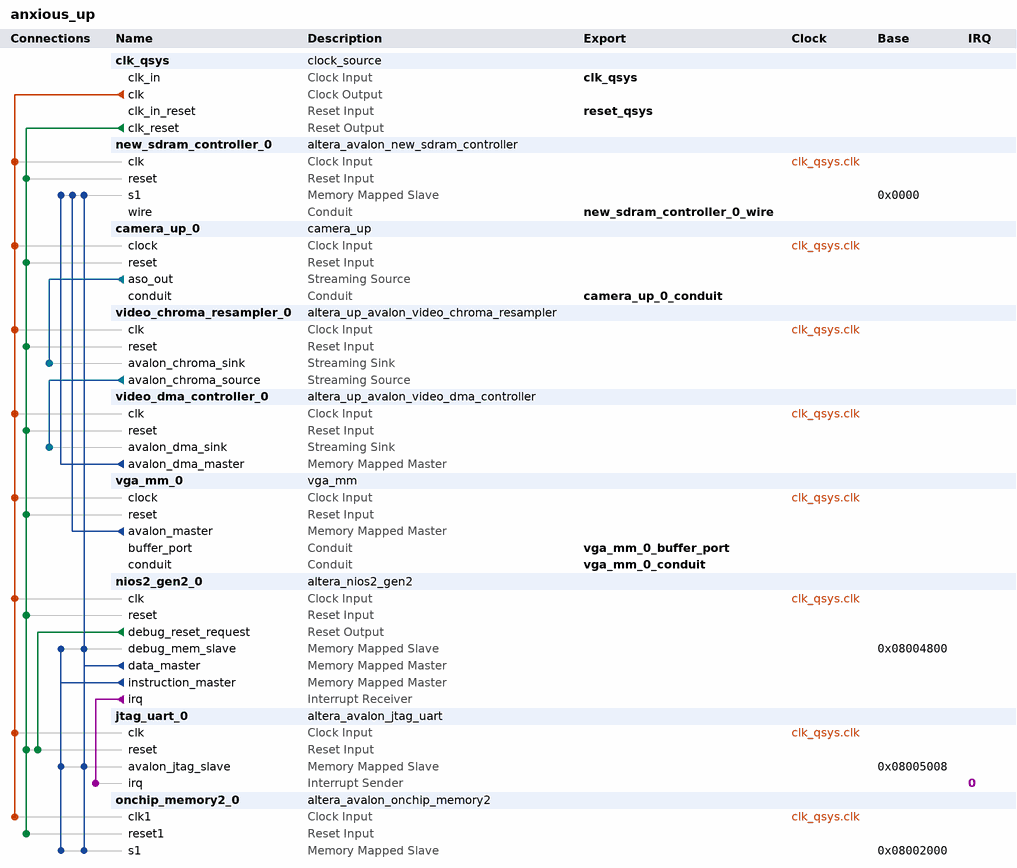
[diagram p0: system contents]
# Platform Designer (Qsys) system anxious_up, Cyclone IV GX EP4CGX150DF31C7
# Parameters at their usual value, and those the tool derives, are not listed.
package require -exact qsys 15.0
create_system anxious_up
set_project_property DEVICE_FAMILY {Cyclone IV GX}
set_project_property DEVICE EP4CGX150DF31C7

add_instance clk_qsys clock_source 15.0
set_instance_parameter_value clk_qsys clockFrequency 50000000

add_instance new_sdram_controller_0 altera_avalon_new_sdram_controller 15.0
set_instance_parameter_value new_sdram_controller_0 TAC 5.5
set_instance_parameter_value new_sdram_controller_0 TRCD 20.0
set_instance_parameter_value new_sdram_controller_0 TRP 20.0
set_instance_parameter_value new_sdram_controller_0 casLatency 3
set_instance_parameter_value new_sdram_controller_0 columnWidth 10
set_instance_parameter_value new_sdram_controller_0 dataWidth 32
set_instance_parameter_value new_sdram_controller_0 generateSimulationModel true
set_instance_parameter_value new_sdram_controller_0 initRefreshCommands 8
set_instance_parameter_value new_sdram_controller_0 model single_Micron_MT48LC4M32B2_7_chip
set_instance_parameter_value new_sdram_controller_0 numberOfBanks 4
set_instance_parameter_value new_sdram_controller_0 numberOfChipSelects 1
set_instance_parameter_value new_sdram_controller_0 powerUpDelay 100.0
set_instance_parameter_value new_sdram_controller_0 refreshPeriod 7.8125
set_instance_parameter_value new_sdram_controller_0 rowWidth 13

add_instance camera_up_0 camera_up 1.0
set_instance_parameter_value camera_up_0 DATA_WIDTH 16
set_instance_parameter_value camera_up_0 FIFO_LENGTH_LOG_2 8

add_instance video_chroma_resampler_0 altera_up_avalon_video_chroma_resampler 15.0

add_instance video_dma_controller_0 altera_up_avalon_video_dma_controller 15.0
set_instance_parameter_value video_dma_controller_0 addr_mode X-Y
set_instance_parameter_value video_dma_controller_0 back_start_address 0
set_instance_parameter_value video_dma_controller_0 color_bits 8
set_instance_parameter_value video_dma_controller_0 color_planes 3
set_instance_parameter_value video_dma_controller_0 dma_enabled true
set_instance_parameter_value video_dma_controller_0 height 480
set_instance_parameter_value video_dma_controller_0 mode {From Stream to Memory}
set_instance_parameter_value video_dma_controller_0 start_address 0
set_instance_parameter_value video_dma_controller_0 width 640

add_instance vga_mm_0 vga_mm 1.0
set_instance_parameter_value vga_mm_0 ADDR_WIDTH 27
set_instance_parameter_value vga_mm_0 BANK 0
set_instance_parameter_value vga_mm_0 DATA_WIDTH 32
set_instance_parameter_value vga_mm_0 FIFO_LENGTH_LOG_2 6
set_instance_parameter_value vga_mm_0 FRAME_PIXELS 307200

add_instance nios2_gen2_0 altera_nios2_gen2 15.0
set_instance_parameter_value nios2_gen2_0 dcache_size 2048
set_instance_parameter_value nios2_gen2_0 exceptionSlave onchip_memory2_0.s1
set_instance_parameter_value nios2_gen2_0 icache_size 4096
set_instance_parameter_value nios2_gen2_0 impl Tiny
set_instance_parameter_value nios2_gen2_0 resetSlave onchip_memory2_0.s1

add_instance jtag_uart_0 altera_avalon_jtag_uart 15.0
set_instance_parameter_value jtag_uart_0 simInteractiveOptions NO_INTERACTIVE_WINDOWS

add_instance onchip_memory2_0 altera_avalon_onchip_memory2 15.0
set_instance_parameter_value onchip_memory2_0 dataWidth 32
set_instance_parameter_value onchip_memory2_0 dualPort false
set_instance_parameter_value onchip_memory2_0 initMemContent true
set_instance_parameter_value onchip_memory2_0 initializationFileName onchip_mem.hex
set_instance_parameter_value onchip_memory2_0 memorySize 8192

# connections
add_connection clk_qsys.clk camera_up_0.clock clock
add_connection clk_qsys.clk jtag_uart_0.clk clock
add_connection clk_qsys.clk new_sdram_controller_0.clk clock
add_connection clk_qsys.clk nios2_gen2_0.clk clock
add_connection clk_qsys.clk onchip_memory2_0.clk1 clock
add_connection clk_qsys.clk vga_mm_0.clock clock
add_connection clk_qsys.clk video_chroma_resampler_0.clk clock
add_connection clk_qsys.clk video_dma_controller_0.clk clock
add_connection clk_qsys.clk_reset camera_up_0.reset reset
add_connection clk_qsys.clk_reset jtag_uart_0.reset reset
add_connection clk_qsys.clk_reset new_sdram_controller_0.reset reset
add_connection clk_qsys.clk_reset nios2_gen2_0.reset reset
add_connection clk_qsys.clk_reset onchip_memory2_0.reset1 reset
add_connection clk_qsys.clk_reset vga_mm_0.reset reset
add_connection clk_qsys.clk_reset video_chroma_resampler_0.reset reset
add_connection clk_qsys.clk_reset video_dma_controller_0.reset reset
add_connection nios2_gen2_0.debug_reset_request jtag_uart_0.reset reset
add_connection nios2_gen2_0.data_master jtag_uart_0.avalon_jtag_slave avalon
set_connection_parameter_value nios2_gen2_0.data_master/jtag_uart_0.avalon_jtag_slave baseAddress 0x08005008
add_connection nios2_gen2_0.data_master new_sdram_controller_0.s1 avalon
set_connection_parameter_value nios2_gen2_0.data_master/new_sdram_controller_0.s1 baseAddress 0x0000
add_connection nios2_gen2_0.data_master nios2_gen2_0.debug_mem_slave avalon
set_connection_parameter_value nios2_gen2_0.data_master/nios2_gen2_0.debug_mem_slave baseAddress 0x08004800
add_connection nios2_gen2_0.data_master onchip_memory2_0.s1 avalon
set_connection_parameter_value nios2_gen2_0.data_master/onchip_memory2_0.s1 baseAddress 0x08002000
add_connection nios2_gen2_0.instruction_master jtag_uart_0.avalon_jtag_slave avalon
set_connection_parameter_value nios2_gen2_0.instruction_master/jtag_uart_0.avalon_jtag_slave baseAddress 0x08005008
add_connection nios2_gen2_0.instruction_master nios2_gen2_0.debug_mem_slave avalon
set_connection_parameter_value nios2_gen2_0.instruction_master/nios2_gen2_0.debug_mem_slave baseAddress 0x08004800
add_connection nios2_gen2_0.instruction_master onchip_memory2_0.s1 avalon
set_connection_parameter_value nios2_gen2_0.instruction_master/onchip_memory2_0.s1 baseAddress 0x08002000
add_connection vga_mm_0.avalon_master new_sdram_controller_0.s1 avalon
set_connection_parameter_value vga_mm_0.avalon_master/new_sdram_controller_0.s1 baseAddress 0x0000
add_connection video_dma_controller_0.avalon_dma_master new_sdram_controller_0.s1 avalon
set_connection_parameter_value video_dma_controller_0.avalon_dma_master/new_sdram_controller_0.s1 baseAddress 0x0000
add_connection camera_up_0.aso_out video_chroma_resampler_0.avalon_chroma_sink avalon_streaming
add_connection video_chroma_resampler_0.avalon_chroma_source video_dma_controller_0.avalon_dma_sink avalon_streaming
add_connection nios2_gen2_0.irq jtag_uart_0.irq interrupt
set_connection_parameter_value nios2_gen2_0.irq/jtag_uart_0.irq irqNumber 0

# exported interfaces
add_interface camera_up_0_conduit conduit end
set_interface_property camera_up_0_conduit EXPORT_OF camera_up_0.conduit
add_interface clk_qsys clock sink
set_interface_property clk_qsys EXPORT_OF clk_qsys.clk_in
add_interface new_sdram_controller_0_wire conduit end
set_interface_property new_sdram_controller_0_wire EXPORT_OF new_sdram_controller_0.wire
add_interface reset_qsys reset sink
set_interface_property reset_qsys EXPORT_OF clk_qsys.clk_in_reset
add_interface vga_mm_0_buffer_port conduit end
set_interface_property vga_mm_0_buffer_port EXPORT_OF vga_mm_0.buffer_port
add_interface vga_mm_0_conduit conduit end
set_interface_property vga_mm_0_conduit EXPORT_OF vga_mm_0.conduit

set_interconnect_requirement {$system} qsys_mm.clockCrossingAdapter HANDSHAKE
set_interconnect_requirement {$system} qsys_mm.enableEccProtection FALSE
set_interconnect_requirement {$system} qsys_mm.insertDefaultSlave FALSE
set_interconnect_requirement {$system} qsys_mm.maxAdditionalLatency 1

save_system anxious_up.qsys
